# EAGLE design OLED_Display_Card (EAGLE 6.4)
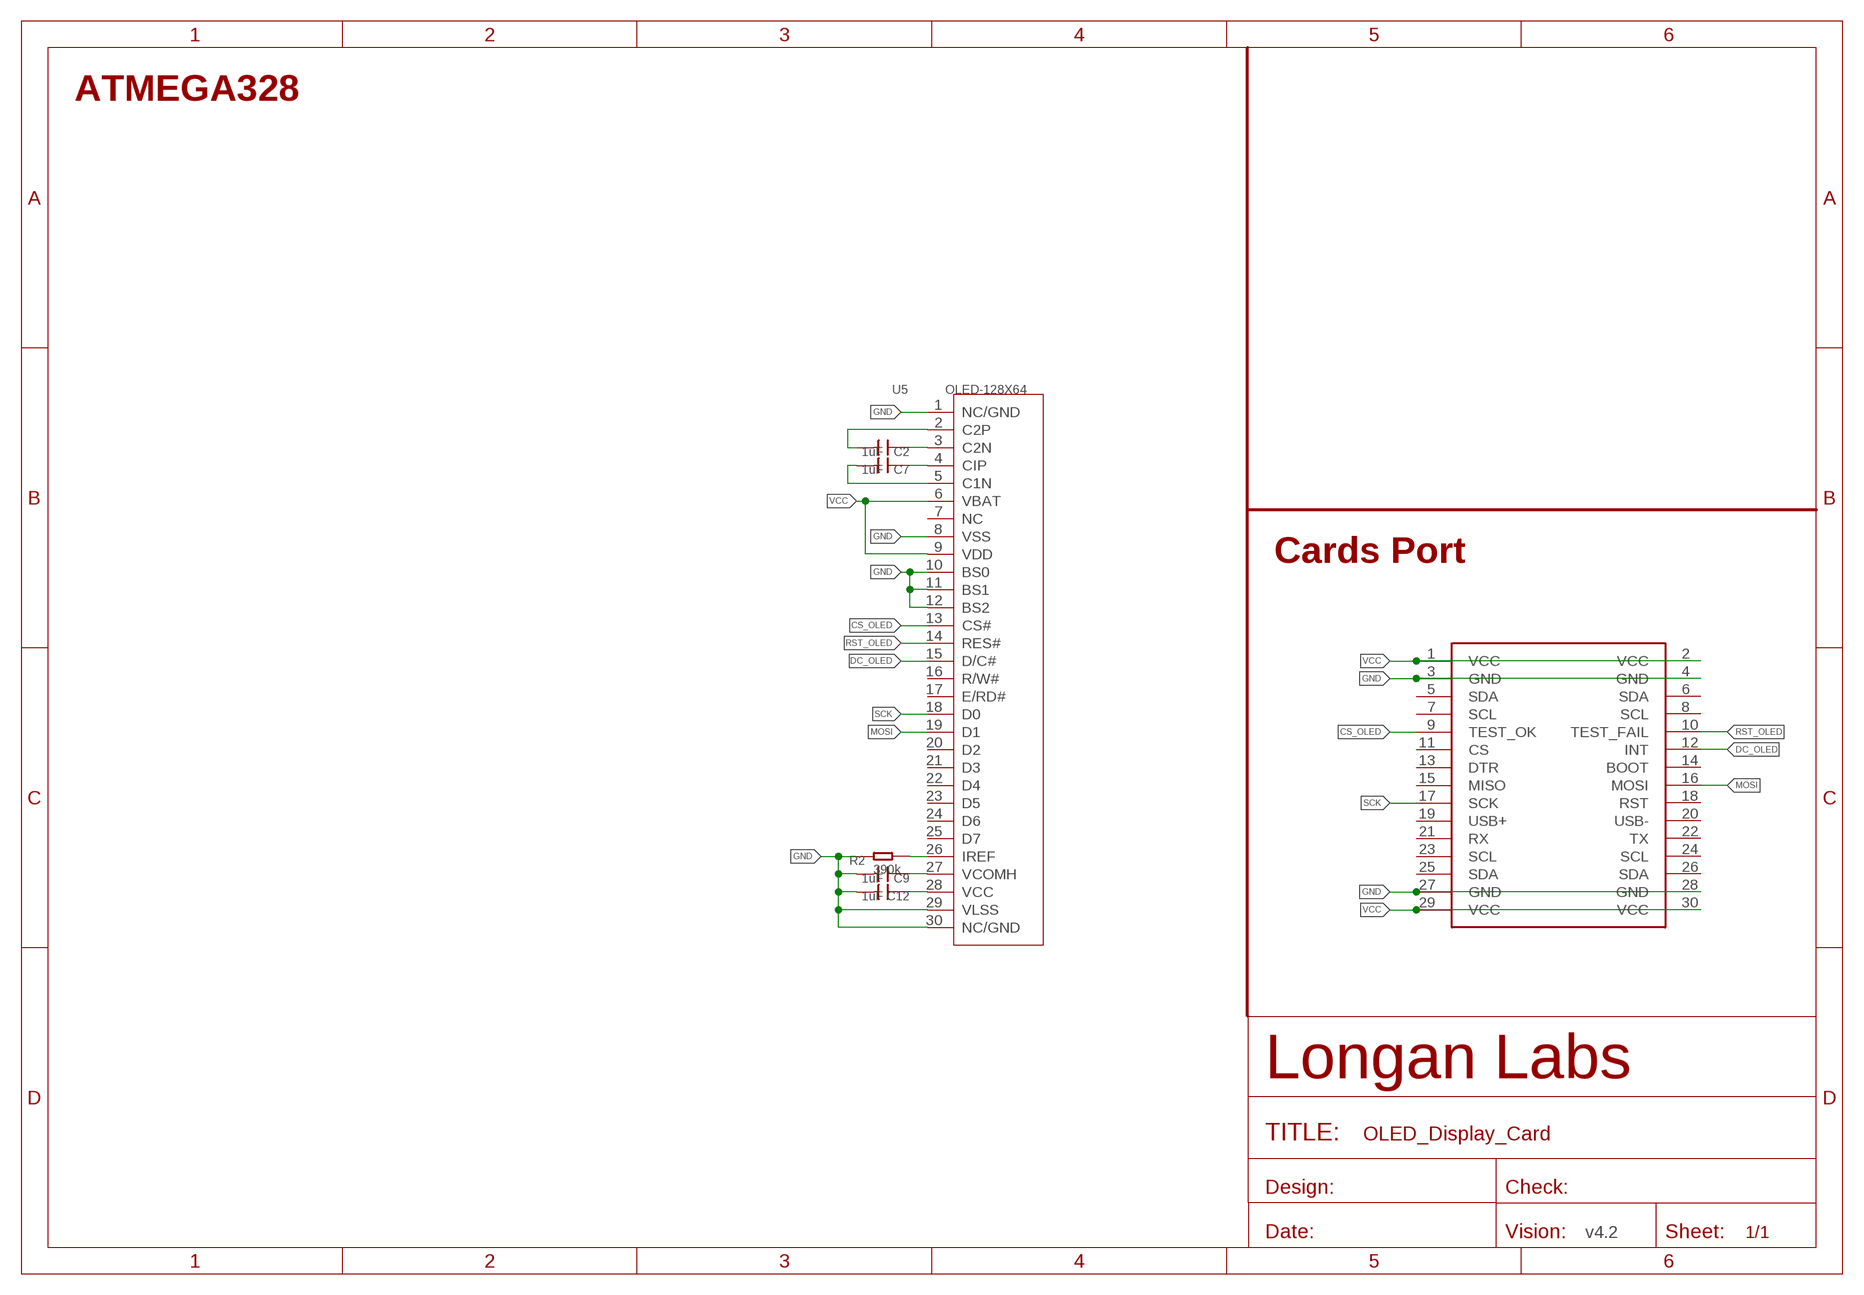
[diagram p0: schematic, sheet 1]

## Parts
C2  1uF  C-0603  [C0603@1]
C7  1uF  C-0603  [C0603@1]
C9  1uF  C-0603  [C0603@1]
C12  1uF  C-0603  [C0603@1]
MOUDLE1  MOUDLE-2X15P-2.54  [MOUDLE-2X15P]
R2  390k  RES-0603  [R0603]
U5  OLED-128X64  [30P-0.7-34.5X12]

## Nets
CS_OLED: MOUDLE1.9(TEST_OK) U5.13(CS#)
DC_OLED: MOUDLE1.12(INT) U5.15(D/C#)
GND: C9.2 C12.2 MOUDLE1.3(GND) MOUDLE1.4(GND) MOUDLE1.27(GND) MOUDLE1.28(GND) R2.1 U5.1(NC/GND) U5.8(VSS) U5.10(BS0) U5.11(BS1) U5.12(BS2) U5.29(VLSS) U5.30(NC/GND)
MOSI: MOUDLE1.16(MOSI) U5.19(D1)
N$2: C2.2 U5.2(C2P)
N$3: C2.1 U5.3(C2N)
N$4: C7.1 U5.4(CIP)
N$5: C7.2 U5.5(C1N)
N$13: R2.2 U5.26(IREF)
N$14: C12.1 U5.28(VCC)
N$15: C9.1 U5.27(VCOMH)
RST_OLED: MOUDLE1.10(TEST_FAIL) U5.14(RES#)
SCK: MOUDLE1.17(SCK) U5.18(D0)
VCC: MOUDLE1.1(VCC) MOUDLE1.2(VCC) MOUDLE1.29(VCC) MOUDLE1.30(VCC) U5.6(VBAT) U5.9(VDD)
Unconnected: MOUDLE1.5(SDA) MOUDLE1.6(SDA) MOUDLE1.7(SCL) MOUDLE1.8(SCL) MOUDLE1.11(CS) MOUDLE1.13(DTR) MOUDLE1.14(BOOT) MOUDLE1.15(MISO) MOUDLE1.18(RST) MOUDLE1.19(USB+) MOUDLE1.20(USB-) MOUDLE1.21(RX) MOUDLE1.22(TX) MOUDLE1.23(SCL) MOUDLE1.24(SCL) MOUDLE1.25(SDA) MOUDLE1.26(SDA) U5.7(NC) U5.16(R/W#) U5.17(E/RD#) U5.20(D2) U5.21(D3) U5.22(D4) U5.23(D5) U5.24(D6) U5.25(D7)

## Notes on the sheet
- ATMEGA328
- Cards Port
- v4.2

## Library data of the parts
C2 C7 C9 C12 = Discrete:C*: Ceramic Capacitors
MOUDLE1 = Longan-moudle:MOUDLE-2X15P-2.54
R2 = Discrete-new:RES
U5 = MOUDLE-CARDS:OLED-128X64

## Net classes
0 default: width 0.152 mm, clearance 0.152 mm
1 power: width 0.152 mm, drill 0.152 mm, clearance 0.152 mm
2 gnd: width 0.152 mm, drill 0.152 mm, clearance 0.152 mm
3 usbvcc: width 0.152 mm, drill 0.152 mm, clearance 0.152 mm

## Board
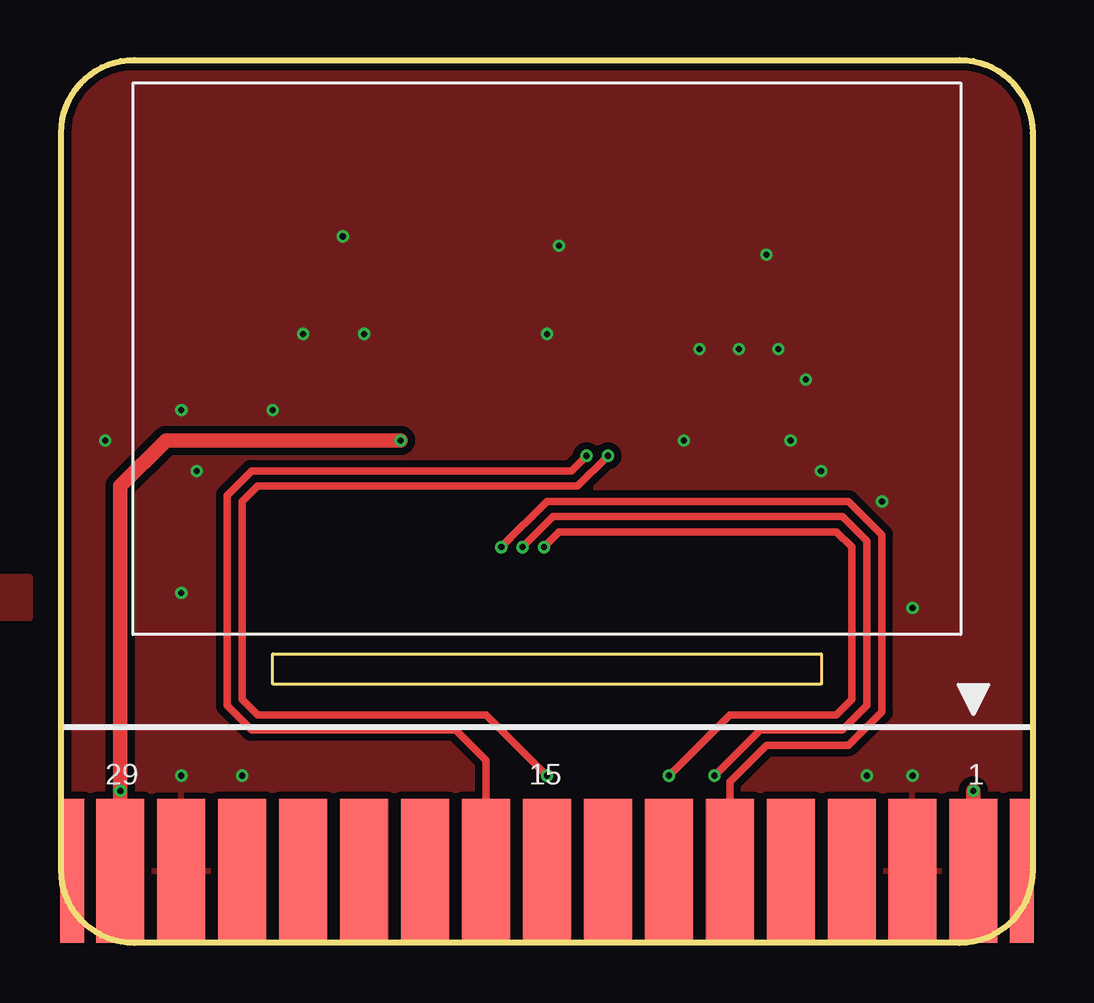
[diagram p1: board, top side]
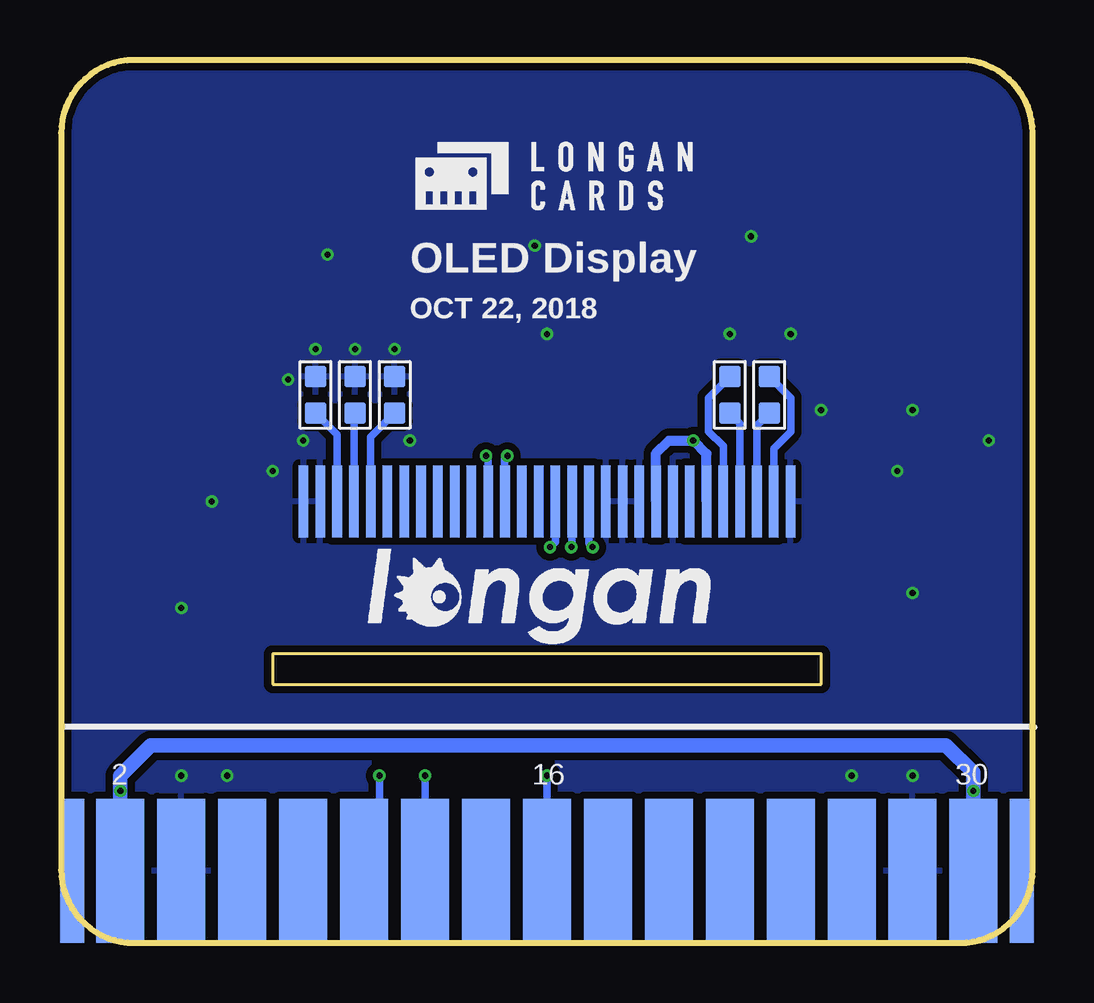
[diagram p2: board, bottom side, seen from below]

Size 40.5 x 36.81 mm. Coordinates in mm from the lower left corner, seen from the top.
Copper layers (1*16): Top 0.035mm / dielectric 1.5mm / Bottom 0.035mm
Design rules "SeeedStudio_2layer_DRU_no_angle_20140221": minimum track width 1mil, minimum drill 10mil, track to track 6mil, track to pad 6mil, pad to pad 6mil, via to via 6mil, smd to smd 0mil, copper to edge 10mil, drill to drill 10mil, minimum pad ring 4mil, minimum via ring 4mil, stop-mask expansion 2mil, vias tented up to drill 25mil, thermal gap 10mil

### Footprints (pad centres in the part's own frame; a part is rotated, then mirrored left to right if it is on the bottom)
C0603@1 = smd 0.889 x 0.889: 1 -0.762,0; 2 0.762,0
MOUDLE-2X15P = smd 2 x 6: 1 17.78,-13.492; 3 15.24,-13.492; 5 12.7,-13.492; 7 10.16,-13.492; 9 7.62,-13.492; 11 5.08,-13.492; 13 2.54,-13.492; 15 0,-13.492; 17 -2.54,-13.492; 19 -5.08,-13.492; 21 -7.62,-13.492; 23 -10.16,-13.492; 25 -12.7,-13.492; 27 -15.24,-13.492; 29 -17.78,-13.492 | smd 2 x 6 bottom: 2 17.78,-13.492; 4 15.24,-13.492; 6 12.7,-13.492; 8 10.16,-13.492; 10 7.62,-13.492; 12 5.08,-13.492; 14 2.54,-13.492; 16 0,-13.492; 18 -2.54,-13.492; 20 -5.08,-13.492; 22 -7.62,-13.492; 24 -10.16,-13.492; 26 -12.7,-13.492; 28 -15.24,-13.492; 30 -17.78,-13.492 | smd 1 x 6: P1 -19.8,-13.492; P4 19.8,-13.492 | smd 1 x 6 bottom: P2 -19.8,-13.492; P3 19.8,-13.492
R0603 = smd 0.889 x 0.889: 1 0,0.762; 2 0,-0.762
30P-0.7-34.5X12 = smd 3 x 0.4 bottom: 1 0,10.15; 2 0,9.45; 3 0,8.75; 4 0,8.05; 5 0,7.35; 6 0,6.65; 7 0,5.95; 8 0,5.25; 9 0,4.55; 10 0,3.85; 11 0,3.15; 12 0,2.45; 13 0,1.75; 14 0,1.05; 15 0,0.35; 16 0,-0.35; 17 0,-1.05; 18 0,-1.75; 19 0,-2.45; 20 0,-3.15; 21 0,-3.85; 22 0,-4.55; 23 0,-5.25; 24 0,-5.95; 25 0,-6.65; 26 0,-7.35; 27 0,-8.05; 28 0,-8.75; 29 0,-9.45; 30 0,-10.15

### Placement (x,y rotation side)
C2  10.98,22.85 90 bottom
C7  12.63,22.85 90 bottom
C9  28.25,22.85 90 bottom
C12  29.9,22.85 90 bottom
MOUDLE1  20.25,16.5 0 top
R2  26.6,22.85 0 bottom
U5  20.25,18.41 90 top
U$1  [LONGAN-CARDS-SMALL]  26.22,30.22 0 bottom
U$3  [LONGAN-SILK-SMALLER]  29.01,11.29 0 bottom

### Tracks (layer width: path | path; a pad name or v marks a point on that pad's centre or on a via)
CS_OLED  (via drill 0.25 pad 0.51)
  Top 0.305: MOUDLE1.9 28,3.13 28,3.55 27.87,3.67 27.87,6.71 29.41,8.24 32.82,8.24 34.22,9.64 34.22,17.01 32.82,18.41 20.25,18.41 v18.34,16.5 18.73,16.88
  Bottom 0.305: U5.13 18.5,16.66 v18.34,16.5
DC_OLED  (via drill 0.25 pad 0.51)
  Top 0.305: v25.33,6.97 27.87,9.52 32.31,9.52 32.95,10.15 32.95,16.5 32.31,17.14 20.76,17.14 v20.12,16.5
  Bottom 0.305: MOUDLE1.12 v25.33,6.97 | U5.15 19.9,16.72 v20.12,16.5
GND  (via drill 0.25 pad 0.51)
  other vias: 11.74,29.45 20.76,29.07 29.39,28.69 5.01,6.97 35.49,6.97 33.59,6.97 7.55,6.97 26.6,24.76 28.25,24.76 29.9,24.76 30.41,20.95 31.68,19.68 31.05,23.48 25.96,20.95 12.63,25.39 10.09,25.39 8.82,22.21 5.64,19.68 5.01,14.6 5.01,22.21 1.84,20.95 20.25,25.39 34.22,18.41 35.49,13.96
  pour Top: -2.74,13.58 -1.34,13.58 -1.34,15.23 -2.74,15.23
  pour Top (isolate 0.305): -0.07,37.45 40.57,37.45 40.57,-0.01 -0.07,-0.01
  pour Bottom (isolate 0.305): -0.07,37.45 40.57,37.45 40.57,-0.01 -0.07,-0.01
MOSI  (via drill 0.25 pad 0.51)
  Top 0.305: v20.25,6.97 17.71,9.52 8.19,9.52 7.55,10.15 7.55,18.41 8.19,19.04 21.52,19.04 v22.79,20.31
  Bottom 0.305: MOUDLE1.16 v20.25,6.97 | U5.19 22.7,20.22 v22.79,20.31
N$2
  Bottom 0.305: U5.2 10.8,20.62 10.09,21.33 10.09,22.72 C2.2
N$3
  Bottom 0.305: U5.3 11.5,21.57 C2.1
N$4
  Bottom 0.305: U5.4 12.2,21.66 C7.1
N$5
  Bottom 0.305: U5.5 12.9,20.71 13.52,21.33 13.52,22.72 C7.2
N$13
  Bottom 0.305: U5.26 27.6,21.09 R2.2
N$14
  Bottom 0.305: U5.28 29,21.19 C12.1
N$15
  Bottom 0.305: U5.27 28.3,22.04 C9.1
RST_OLED  (via drill 0.25 pad 0.51)
  Top 0.305: v27.23,6.97 29.14,8.88 32.57,8.88 33.59,9.9 33.59,16.75 32.57,17.77 20.5,17.77 v19.23,16.5
  Bottom 0.305: MOUDLE1.10 27.23,3.64 v27.23,6.97 | U5.14 19.2,16.53 v19.23,16.5
SCK  (via drill 0.25 pad 0.51)
  Top 0.305: MOUDLE1.17 17.71,7.61 16.44,8.88 7.93,8.88 6.91,9.9 6.91,18.66 7.93,19.68 21.27,19.68 v21.9,20.31
  Bottom 0.305: U5.18 22.03,18.43 22.03,20.18 v21.9,20.31
VCC  (via drill 0.25 pad 0.51)
  Top 0.61: MOUDLE1.2 v38.03,6.34 | MOUDLE1.30 v2.47,6.34 2.47,19.04 4.38,20.95 v14.15,20.95
  Bottom 0.406: U5.6 13.6,20.39 v14.15,20.95 15.17,20.95 15.7,20.41 U5.9
  Bottom 0.61: MOUDLE1.30 v2.47,6.34 2.47,7.1 3.61,8.24 36.76,8.24 38.03,6.97 v38.03,6.34 MOUDLE1.2

### Text on the board
bPlace: OLED Display | OCT 22, 2018